# Altium schematic sheet RF.SchDoc: Radio Frequency
size A4; Author: Robin Geißler; CompanyName: Fraunhofer EMFT; DrawnBy: Robin Geißler; Revision: 1.1.; SheetNumber: 6; SheetTotal: 6
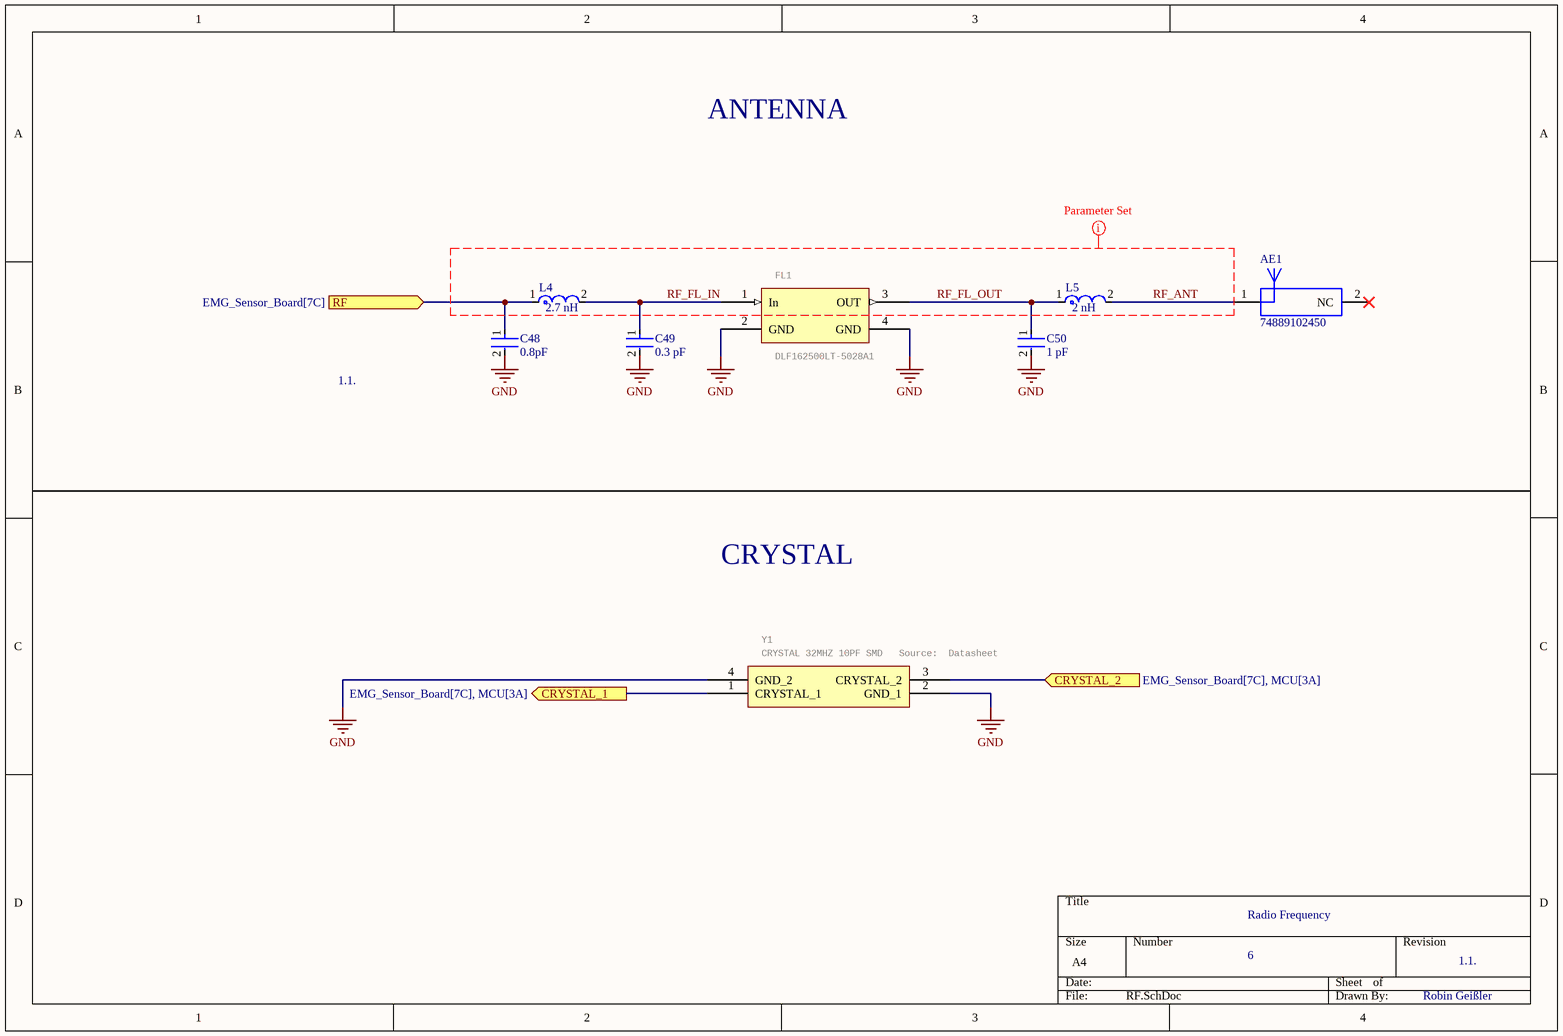
[diagram p0: RF.SchDoc]

## Parts
AE1  74889102450  [74889102450]
C48  0.8pF  [FP-GCM188-0_1-IPC_C]
C49  0.3 pF  [FP-GQM187-0_15-IPC_A]
C50  1 pF  [FP-C0603C-CF-MFG]
FL1  DLF162500LT-5028A1  [DLF162500LT5028A1]
L4  2.7 nH  [FP-LQG15HH_02-IPC_C]
L5  2 nH  [FP-LQP03TG_02-IPC_A]
Y1  CRYSTAL 32MHZ 10PF SMD   Source:  Datasheet  [NX2016SA32MEXS00ACS06465]

## Ports
CRYSTAL_1 (out, see EMG_Sensor_Board[7C], MCU[3A]), CRYSTAL_2 (in, see EMG_Sensor_Board[7C], MCU[3A]), RF (in, see EMG_Sensor_Board[7C])

## Nets
GND: C48.2 C49.2 C50.2 FL1.2(GND) FL1.4(GND) Y1.2(GND_1) Y1.4(GND_2)
CRYSTAL_1: Y1.1(CRYSTAL_1) ; port CRYSTAL_1
CRYSTAL_2: Y1.3(CRYSTAL_2) ; port CRYSTAL_2
RF: C48.1 L4.1 ; port RF
RF_ANT: AE1.1(Feed) L5.2
RF_FL_IN: C49.1 FL1.1(In) L4.2
RF_FL_OUT: C50.1 FL1.3(OUT) L5.1

Not connected (* = marked no-connect by the designer): AE1 2(NC)*

## Layout directives
net class RF: RF_ANT, RF_FL_IN, RF_FL_OUT

## Notes on the sheet
- ANTENNA
- CRYSTAL

## Library data of the parts
AE1 = CMP-03913-126098686-1: 74889102450 Chip Antenna, 2.45Ghz, 9Mm X 2Mm X 1Mm Rohs Compliant: Yes; Current Rating: 2A; Impedance: 50Ω; Height: 1.01mm; RoHS: Compliant; Max Operating Temperature: 85°C; NexarPartId: 126098686; Min Operating Temperature: -40°C; Width: 2mm; Length: 9mm
C48 = CMP-06035-009191-1: Ceramic Capacitor for Automotive 0.8pF  ±0.1pF 100VDC C0G 0603 Paper T/R
C49 = CMP-06035-023113-1: Ceramic Capacitor 0.3pF ±0.05pF 250VDC C0G 0603 Paper T/R
C50 = CMP-2006-03328-2: CAP CER 1PF 50V C0G/NP0 0603; Manufacturer: KEMET; Manufacturer Part Number: C0603C109C5GACTU; Value: 1.0 pF; Temperature Characteristic: C0G; Tolerance: 0.25 pF; Temperature Coefficient: 30ppm/°C; Automotive Grade: Grade 1; Material: Ceramic; Device Class L1: Passive Components; Temperature Range High: +125°C; Temperature: -55°C to +125°C; Height: 0.87mm; Digikey Description: CAP CER 1PF 50V C0G/NP0 0603; Voltage Rating: 50 V; ComponentLink2Description: Datasheet; Capacitance: 1.0 pF; Lead Free: Yes; ComponentLink2URL: https://api.kemet.com/component-edge/download/datasheet/C0603C100J5GACAUTO.pdf; Mouser Description: Multilayer Ceramic Capacitors MLCC - SMD/SMT 50volts 1.0pF C0G 0.25%; Temperature Range Low: -55°C; Device Class L3: Ceramic Capacitors; Device Class L2: Capacitors; Automotive: Yes; RoHS: TRUE; Package: C0603C-CF; Category: Cap; Octopart: https://octopart.com/c0603c109c5gactu-kemet-107248
FL1 = DLF162500LT-5028A1: Signal Conditioning LTCC LOW PASS FLTR 2400-2500MHz   Source:  Datasheet; Manufacturer_Name: TDK; Manufacturer_Part_Number: DLF162500LT-5028A1; Mouser_Part_Number: 810-DLF16250LT5028A1; Mouser_Price-Stock: https://www.mouser.co.uk/ProductDetail/TDK/DLF162500LT-5028A1?qs=U%2FZX79kHR%2FlwIbAISCs3qA%3D%3D; Arrow_Part_Number: DLF162500LT-5028A1; Arrow_Price-Stock: https://www.arrow.com/en/products/dlf162500lt-5028a1/tdk?region=nac; Height: 0.4mm
L4 = CMP-2000-06580-2: Multilayer type RF Inductor 2.7nH ±0.3nH 0.12Ω 800mA 0402; Max DC Current: 300mA; Q Factor: 8; Core Material: Air; Test Frequency: 100MHz; Shielding: Unshielded; Self Resonant Frequency: 6GHz; DC Resistance (DCR): 150mR; Packaging: Tape and Reel; Depth: 0.55mm; DC Current: 300mA; Length: 1mm; Current Rating: 300mA; Lead Free: Lead Free; Max Operating Temperature: 125°C; Mount: Surface Mount; Height - Seated (Max): 0.022inch; Case Code (Imperial): 0402; Height: 0.5mm; Termination: SMD/SMT; Package Quantity: 10000; Radiation Hardening: No; Width: 0.5mm; Case Code (Metric): 1005; Min Operating Temperature: -55°C; Military Standard: Not; Case/Package: 0402; Inductance: 2.7nH
L5 = CMP-06042-013297-1: Film type RF Inductor 2nH ±0.1nH 600mA 0.15Ω 0201 (0603); Current: 400mA; DC Resistance (DCR): 150mR; Core Material: Non-Magnetic; Q Factor: 14; Shielding: Unshielded; Self Resonant Frequency: 12.5GHz; Test Frequency: 500MHz; Height - Seated (Max): 0.013inch; Case/Package: 0201; Depth: 0.33mm; Width: 0.012inch; Mount: Surface Mount; Case Code (Imperial): 0201; Packaging: Tape and Reel; Max DC Current: 600mA; Resistor Type: Thin Film; Case Code (Metric): 0603; Length: 0.6mm; Termination: SMD/SMT; Max Operating Temperature: 125°C; Inductance: 2nH; REACH SVHC: No SVHC; DC Current: 600mA; Package Quantity: 15000; Height: 0.3mm; Military Standard: Not; Min Operating Temperature: -55°C; Current Rating: 600mA
Y1 = NX2016SA-32M-EXS00A-CS06465: Manufacturer_Name: NDK; GateName_1: G$1; SymbolName_1: NX2016SA-32M-EXS00A-CS06465; LibraryName: NX2016SA-32M-EXS00A-CS06465; DeviceSetName: NX2016SA-32M-EXS00A-CS06465; Package: NX2016SA32MEXS00ACS06465; Manufacturer_Part_Number: NX2016SA-32M-EXS00A-CS06465; Mouser_Part_Number: 344-NX2016SA32S06465; Mouser_Price-Stock: https://www.mouser.co.uk/ProductDetail/NDK/NX2016SA-32M-EXS00A-CS06465?qs=w%2Fv1CP2dgqr82b0JjRnv4A%3D%3D; Height: 0.5mm